# Altium schematic sheet Hike_Buddy Schematic.SchDoc
size A; SheetNumber: 1; SheetTotal: 1
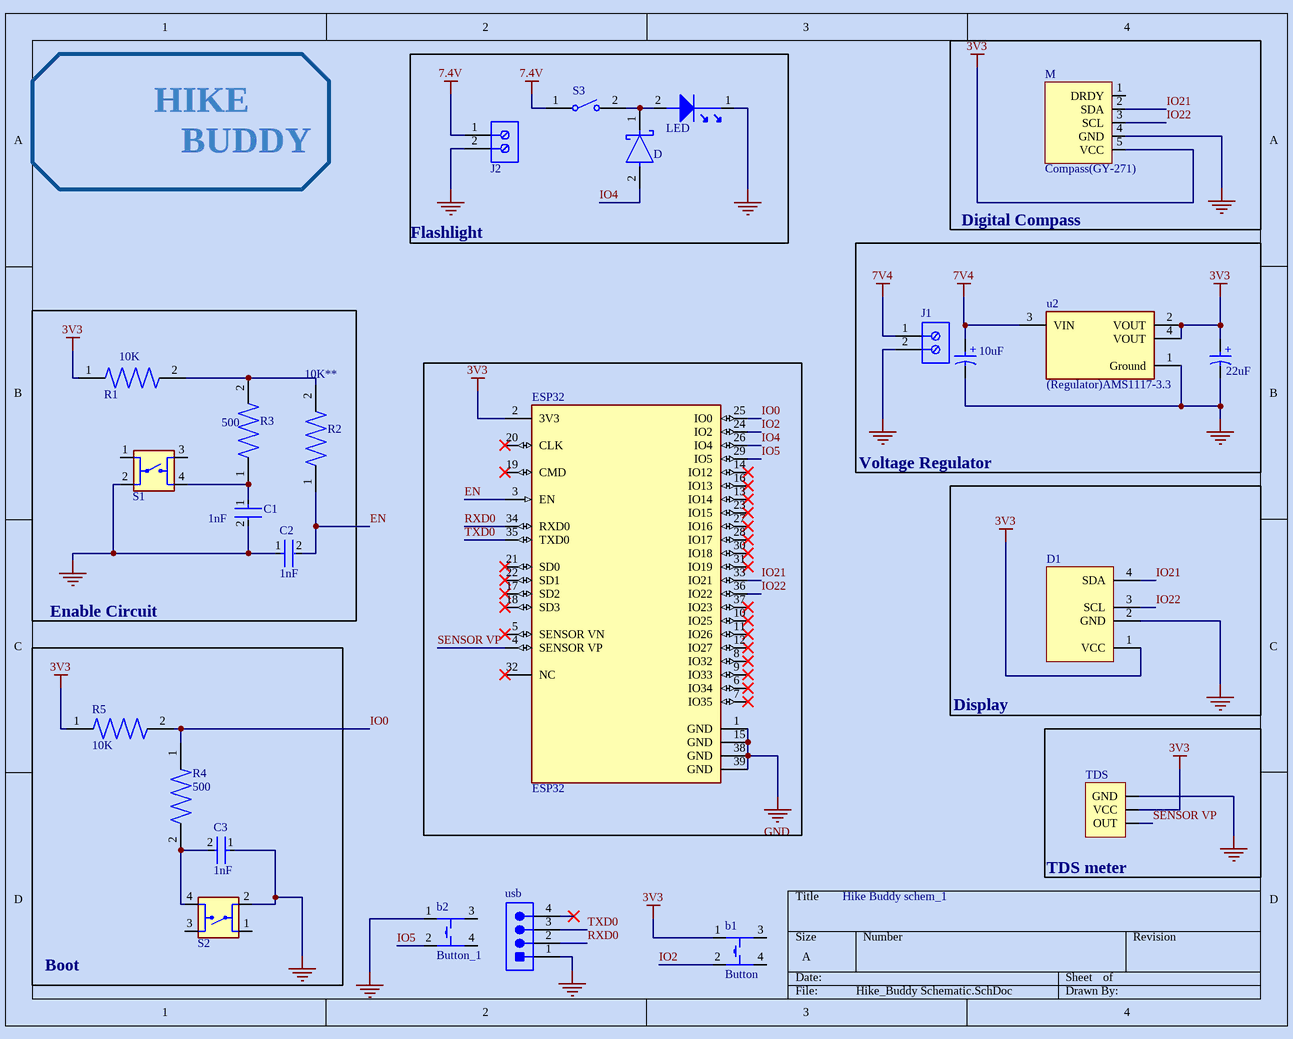
[diagram p0: Hike_Buddy Schematic.SchDoc]

## Parts
10uF  860010372001  [WCAP-ATG8_D5H11]  (value not drawn)
22uF  860020472004  [WCAP-ATG5_D5H11]  (value not drawn)
b1  Button  [Push Button]
b2  Button_1  [Push Button]
C1  1nF  [FP-VY2102M29Y5US6TV7-MFG]
C2  1nF  [FP-VY2102M29Y5US6TV7-MFG]
C3  1nF  [FP-VY2102M29Y5US6TV7-MFG]
D  1N5817  [FP-DO-41-MFG]  (value not drawn)
D1  OLED Display  [Display]  (value not drawn)
ESP32  ESP32  [ESP32]
J1  282836-2  [TECO-282836-2_V]  (value not drawn)
J2  282836-2  [TECO-282836-2_V]  (value not drawn)
L  LED  [LED]
M  Compass(GY-271)  [QMC]
R1  10K  [R1]
R2  10K**  [R1]
R3  500  [R1]
R4  500  [R1]
R5  10K  [R1]
S1  Switch  [Switch]  (value not drawn)
S2  Switch2  [Switch]  (value not drawn)
S3  FSMSM  [TECO-FSMSM-2_V]  (value not drawn)
TDS  (no value)  [tds]
u2  (Regulator)AMS1117-3.3  [FP-AMS1117-IPC_C]
usb  640456-4  [TECO-640456-4]  (value not drawn)

## Blocks framed on the sheet
Flashlight: D J2 L S3
Digital Compass: M
Voltage Regulator: 10uF 22uF J1 u2
Enable Circuit: C1 C2 R1-R3 S1
Display: D1
Boot: C3 R4 R5 S2
TDS meter: TDS

## Nets
3V3: 22uF.1(P) b1.1 D1.1(VCC) ESP32.2(3V3) M.5(VCC) R1.1 R5.1 TDS.2(VCC) u2.2(VOUT) u2.4(VOUT)
7.4V: J2.1 S3.1
7V4: 10uF.1(P) J1.1 u2.3(VIN)
GND: 10uF.2(N) 22uF.2(N) b2.1 C1.2 C2.1 C3.1 D1.2(GND) ESP32.1(GND) ESP32.15(GND) ESP32.38(GND) ESP32.39(GND) J1.2 J2.2 L.1 M.4(GND) S1.2 S2.2 TDS.1(GND) u2.1(Ground) usb.1
EN: C2.2 ESP32.3(EN) R2.1
IO0: ESP32.25(IO0) R4.1 R5.2
IO2: b1.2 ESP32.24(IO2)
IO4: D.2(A) ESP32.26(IO4)
IO5: b2.2 ESP32.29(IO5)
IO21: D1.4(SDA) ESP32.33(IO21) M.2(SDA)
IO22: D1.3(SCL) ESP32.36(IO22) M.3(SCL)
RXD0: ESP32.34(RXD0) usb.2
SENSOR VP: ESP32.4(SENSOR_VP) TDS.3(OUT)
TXD0: ESP32.35(TXD0) usb.3
NetC1_1: C1.1 R3.1 S1.4
NetC3_2: C3.2 R4.2 S2.4
NetD_1: D.1(C) L.2 S3.2
NetR1_2: R1.2 R2.2 R3.2

Not connected (* = marked no-connect by the designer): b1 3 4; b2 3 4; ESP32 5(SENSOR_VN)* 6(IO34)* 7(IO35)* 8(IO32)* 9(IO33)* 10(IO25)* 11(IO26)* 12(IO27)* 13(IO14)* 14(IO12)* 16(IO13)* 17(SD2)* 18(SD3)* 19(CMD)* 20(CLK)* 21(SD0)* 22(SD1)* 23(IO15)* 27(IO16)* 28(IO17)* 30(IO18)* 31(IO19)* 32(NC)* 37(IO23)*; M 1(DRDY); S1 1 3; S2 1 3; usb 4*

## Notes on the sheet
- HIKE
- BUDDY
- Hike Buddy schem_1
- (in symbol CMP-03913-53914186-1) +
- (in symbol CMP-03913-54007181-1) +

## Library data of the parts
10uF = CMP-03913-54007181-1: 860010372001 Cap Aluminum Lytic 10uF 16V 20% (5 X 11mm) Radial 2mm 44mA 2000h 85C; Capacitance: 10µF; Leakage Current: 3µA; Life (Hours): 2000hours; Polarity: Polar; Packaging: Tape & Box (TB); Height - Seated (Max): 12.4968mm; Lead Pitch: 2.0066mm; Material: Aluminium; RoHS: Compliant; NexarPartId: 54007181; Voltage Rating: 16V; Mount: Through Hole; Tolerance: 20%; Height: 11mm; Pitch: 2mm; Ripple Current: 44mA; Diameter: 5mm; Case/Package: Radial; Min Operating Temperature: -40°C; Max Operating Temperature: 85°C; Voltage Rating (DC): 16V; REACH SVHC: Unknown; Length: 11mm
22uF = CMP-03913-53914186-1: 860020472004 WCAP-ATG5 Aluminum Electrolytic Capacitors; Voltage Rating: 25V; Polarity: Polar; Pitch: 2mm; Leakage Current: 5.5µA; Life (Hours): 2000hours; Capacitance: 22µF; Ripple Current: 58mA; Tolerance: 20%; Min Operating Temperature: -40°C; Packaging: Tape & Box (TB); Lead Pitch: 2.0066mm; Diameter: 5mm; Height - Seated (Max): 12.4968mm; RoHS: Compliant; Mount: Through Hole; Case/Package: Radial; Max Operating Temperature: 105°C; Length: 11mm; NexarPartId: 53914186
C1-C3 = CMP-00030-42817980-1: VY2102M29Y5US6TV7 Cap Ceramic Suppression X1/Y2 0.001uF 440VAC/300VAC Y5U 20% (7.5 X 5mm) Radial 7.5mm 125C T/R; Lead/Base Style: Kinked; Lead Diameter: 600µm; Voltage: 300V; Voltage Rating: 1kV; Capacitance: 1nF; Case/Package: Radial; Height: 10.5mm; REACH SVHC: Unknown; Packaging: Tape & Reel (TR); Lead Free: Lead Free; RoHS: Compliant; Min Operating Temperature: -40°C; Max Operating Temperature: 125°C; Termination: Radial; Composition: Ceramic; Depth: 5mm; Dielectric: Y5U; Diameter: 7.5mm; Lead Pitch: 7.5mm; Schedule B: 8532230060, 8532230060; Radiation Hardening: No; Tolerance: 20%; Height - Seated (Max): 11.5062mm; Voltage Rating (AC): 300V; Material: Ceramic; Mount: Through Hole; NexarPartId: 42817980
D = CMP-12187-000037-1: DIODE SCHOTTKY 20V 1A DO41; Max Forward Surge Current (Ifsm): 25A; Forward Voltage: 450mV; Max Reverse Leakage Current: 500uA; Element Configuration: Single; Polarity: Standard; Capacitance: 110pF; Length: 5.2mm; Min Operating Temperature: -65°C; Series: -; Packaging: Cut Tape; Output Current: 1A; RoHS Compliant: Yes; Max Surge Current: 25A; Voltage Rating (DC): 20V; Number of Pins: 2; Width: 2.7mm; Max Reverse Voltage (DC): 20V; Height: 2.7mm; Weight: 0.01lb; Max Operating Temperature: 150°C; Current Rating: 1A; Lead Free: Lead Free; Case/Package: DO-41; Radiation Hardening: No; Package Quantity: 2000; Forward Current: 1A; Max Repetitive Reverse Voltage (Vrrm): 20V; Peak Non-Repetitive Surge Current: 25A; REACH SVHC: No SVHC; Average Rectified Current: 1A; Max Reverse Current: 500uA; Mount: Through Hole
D1 = Display: 0.96 inch 128X64 OLED Display Module Blue I2C IIC
ESP32 = ESP32W: ESP-WROOM-32
J1 J2 = CMP-1684-00017-1: Female Header, Pitch 5 mm, 1 x 2 Position, Height 10 mm, Tail Length 3.5 mm, Rohs, Bulk; Manufacturer: TE Connectivity; Wire Gauge: 16-30AWG; Product Training Modules: Wire-to-BoardEurostyleTerminalBlocks; Clamp Material - Plating: Brass-NickelPlated; Voltage: 300V; Mating Orientation: HorizontalwithBoard; Current: 13.5A; Pitch: 0.197"(5.00mm); Screw Thread: M3; 3D Model: 282836-2.pdf; Other Names: 5ULV-02B / A98076; Dynamic Catalog: BuchananSeries; Number of Levels: 1; Torque - Screw: 0.68Nm(6Lb-In); Featured Product: EurostyleTerminalBlockConnectors; Positions Per Level: 2; Wire Termination: Screw-RisingCageClamp; Datasheet URL: http://www.te.com.cn/commerce/DocumentDelivery/DDEController?Action=showdoc&DocId=Catalog+Section%7F1308389_EUROSTYLE_TERMINAL_BLOCKS%7F0607%7Fpdf%7FEnglish%7FENG_CS_1308389_EUROSTYLE_TERMINAL_BLOCKS_0607.pdf%7F282836-2; Color: Green; Family: TerminalBlocks-WiretoBoard; RoHS Information: 282836-2StatementofCompliance; Standard Package: 300; Contact Material - Plating: Brass-TinPlated; Manufacturer URL: http://www.te.com; Housing Material: Polyamide(PA66),Nylon6/6; Features: Interlocking(Side); Package Description: Female Header, Pitch 5 mm, 1 x 2 Position, Height 10 mm, Tail Length 3.5 mm; Mounting Type: ThroughHole; Package Reference: THD; Packaging: Bulk; Series: Buchanan; Category: Connectors,Interconnects; Screw Material - Plating: Brass-NickelPlated
M = Magnetometer: GY-271 HMC5883L 3-Axis Compass Magnetometer Module
R1 = R1
R2 = R2
R3 = R3
R4 = R4
R5 = R5
S3 = CMP-2000-07511-1: FSMSM Push Button Switch, 50 mA, -35 to 85 degC, 2-Pin SMD, RoHS, Bulk; Manufacturer: TE Connectivity; Actuator Length: 1.07mm; Electrical Life: 20000Cycles; Actuator Material: Polyamide; Current Rating: 50mA; Illumination Type: Illuminated; Voltage Rating (DC): 24V; Contact Resistance: 100mOhm; Case\/Package: SMD/SMT; Operating Force: 180gf; Switch Travel: 0.25mm; Max Voltage Rating (DC): 12V; Throw Configuration: SPST; Packaging: LoosePiece; Max Operating Temperature: 85degC; ELV: Compliant; Package Description: 2-Pin Surface Mount Device, Body 6 x 3.5 mm, Pitch 9.19 mm; RoHSCompliant: true; Manufacturer URL: http://www.te.com/; Contact Plating: Silver; Contact Material: Brass; Mounting Technology: SurfaceMount; Contact Current Rating: 50mA; Datasheet Version: Rev. C2, 08/2014; Datasheet URL: http://www.te.com/commerce/DocumentDelivery/DDEController?Action=showdoc&DocId=Customer+Drawing%7F1437566-3%7FC2%7Fpdf%7FEnglish%7FENG_CD_1437566-3_C2_1437566_3_1_c.dwg.pdf%7F1437566-3; Mechanical Life: 20000Cycles; Package Reference: FSMSM; REACH SVHC: Unknown; Orientation: Straight; Min Operating Temperature: -35degC; Lead Free: LeadFree; Termination: GullWing; Package Quantity: 1000; Mount: SurfaceMount
TDS = tds
u2 = CMP-209535-000001-1: LDO Voltage Regulators 1A, 3.3V; Manufacturer: Advanced Monolithic Systems; Dropout Voltage: 1.1V; Output Type: Fixed; Nominal Supply Current: 5mA; Max Power Dissipation: 1.2W; Max Supply Voltage: 15V; Number Of Outputs: 1; Standoff Height: 0.64mm; Max Junction Temp: +125°C; Height: 1.8mm; Package: AMS1117; Device Class L2: Power Management ICs; ComponentLink2Description: Datasheet; ComponentLink2URL: http://www.advanced-monolithic.com/pdf/ds1117.pdf; Category: IC; RoHS: TRUE; Automotive: No; Device Class L1: Integrated Circuits (ICs); Output Current: 1A; Device Class L3: Voltage Regulators - Linear; Temperature: -40°C to +125°C; Output Voltage: 3.3V; Manufacturer Part Number: AMS1117-3.3; Temperature Range Low: -40°C; Octopart: https://octopart.com/ams1117-3.3-advanced+monolithic+systems-25899300; Lead Free: Yes; Ipc Land Pattern Name: SOT229P700X180-4; Temperature Range High: +125°C
usb = CMP-2000-05419-1: Male Header, Pitch 2.54 mm, 1 x 4 Position, Height 10.03 mm, Tail Length 3.56 mm, RoHS, Bulk; Manufacturer: TE Connectivity; Material, Housing: Polyester; Primary Type: InterconnectSystem; Mount Angle: Vertical; Color, Housing: White; Current, Rating: 5 / A; Agency Approvals: CSA,UL; Contact Termination Area Plating: Tin; Temperature, Operating: -55to+105 / degC; Standards: RoHSCompliant,ELVCompliant,UL94V-0; Number of Positions: 4; Brand/Series: MTA-100Series; Angle: Straight; Pin Spacing: 0.1 / "; Material, Contact: CopperAlloy; Connector Type: MTA-100; Special Features: Pinstrip; Mounting Hole Size: 0.04 / "; Contact Centerline Spacing: 0.100 / in.; Voltage, Rating: 250 / V; Manufacturer URL: http://www.te.com/; Length, Pin: 0.14 / "; Length, Overall: 0.4 / "; Color: White; Flammability Rating: UL94V-0; Mounting Type: PCMount; Termination: Solder; Datasheet URL: https://datasheet.ciiva.com/16286/eng-ds-82056-mta-0608-16286228.pdf; Number of Contacts: 4; Contact Shape: Square; Contact Mating Area Plating: Tin; Length, Terminal Post: 0.14 / in.; Size, Post: 0.025 / in.; Contact Plating: Tin; Type: PCBPlug; Datasheet Version: Dec-14; Number of Rows: 1